# Altium schematic sheet mini80开发板小系统.SchDoc
size A3
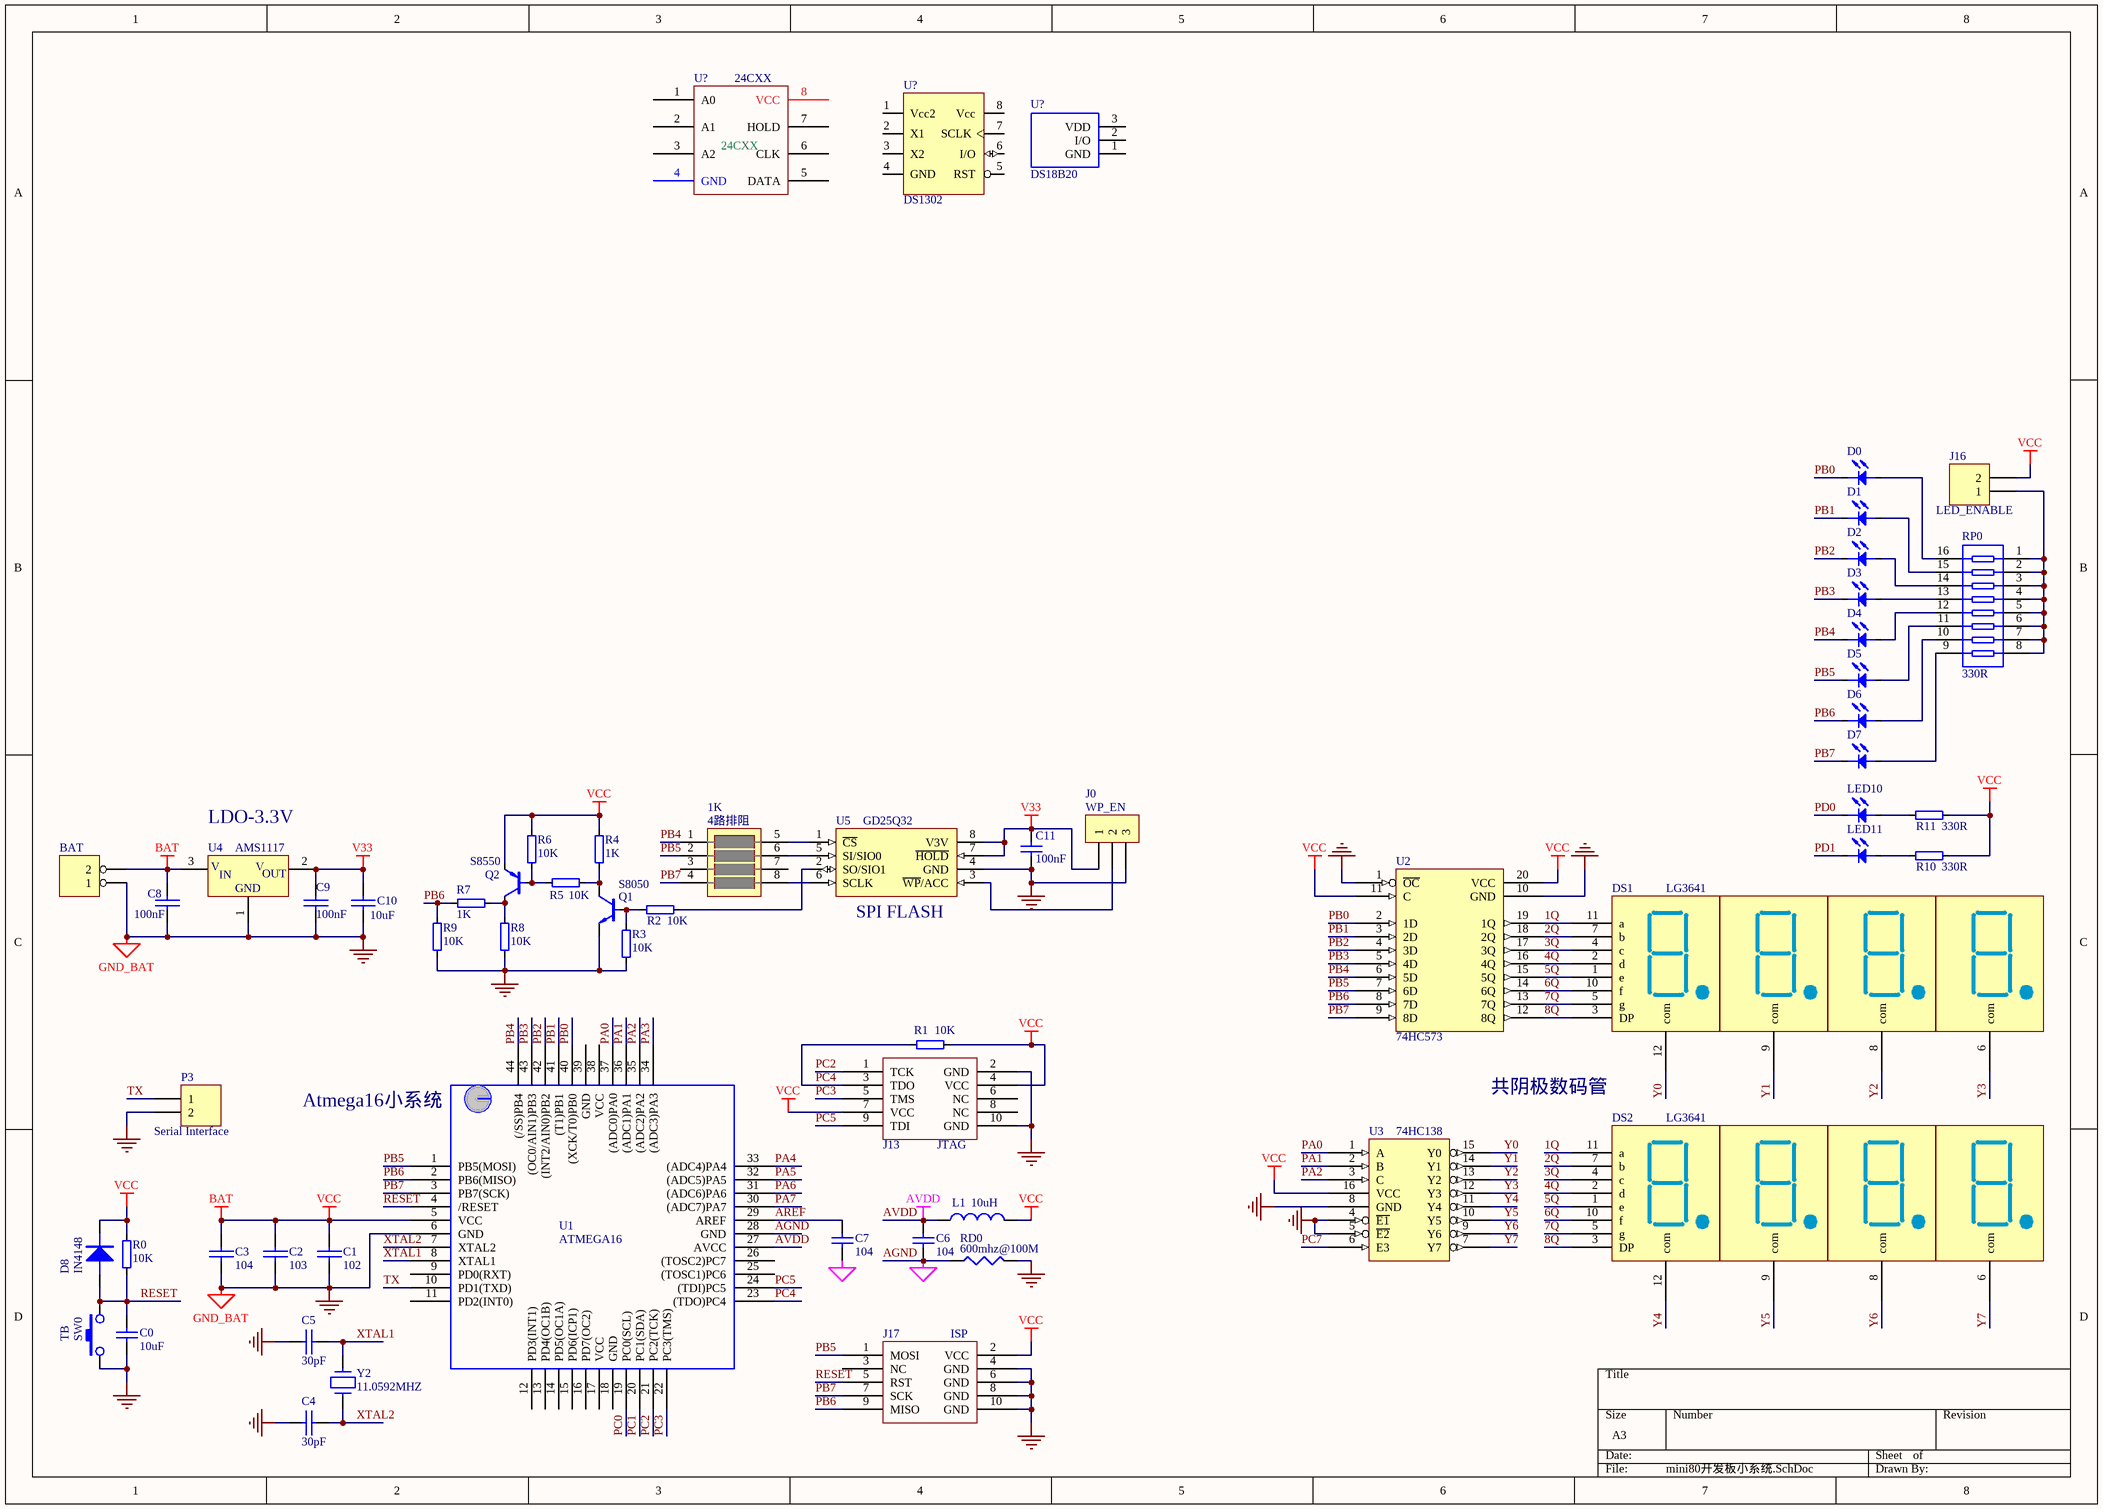
[diagram p0: mini80开发板小系统.SchDoc]

## Parts
(Parts that share a designator on the sheet are numbered #1, #2 ... from top to bottom, then left to right.)
1K  4路排阻
BAT  (no value)  [PH2.0-2P]
C0  10uF  [C-0603]
C1  102  [C-0603]
C2  103  [C-0603]
C3  104  [C-0603]
C4  30pF  [C-0603]
C5  30pF  [C-0603]
C6  104  [C-0603]
C7  104  [C-0603]
C8  100nF  [C-0603]
C9  100nF  [C-0603]
C10  10uF  [C-0805]
C11  100nF  [C-0603]
D0  (no value)  [LED]
D1  (no value)  [LED]
D2  (no value)  [LED]
D3  (no value)  [LED]
D4  (no value)  [LED]
D5  (no value)  [LED]
D6  (no value)  [LED]
D7  (no value)  [LED]
D8  IN4148  [DO-214AC(SMA)]
DS1  LG3641
DS2  LG3641
J0  WP_EN  [DG1283-5.0]
J13  JTAG
J16  LED_ENABLE  [HDR1X2]
J17  ISP
L1  10uH  [R-0603]
LED10  (no value)  [LED]
LED11  (no value)  [LED]
P3  Serial Interface  [HDR1X2]
Q1  S8050  [TO-92]
Q2  S8550  [TO-92]
R0  10K  [AXIAL0.3]
R1  10K  [AXIAL0.3]
R2  10K  [AXIAL0.3]
R3  10K  [AXIAL0.3]
R4  1K  [AXIAL0.3]
R5  10K  [AXIAL0.3]
R6  10K  [AXIAL0.3]
R7  1K  [AXIAL0.3]
R8  10K  [AXIAL0.3]
R9  10K  [AXIAL0.3]
R10  330R  [AXIAL0.3]
R11  330R  [AXIAL0.3]
RD0  600mhz@100M  [R-0603]
RP0  330R  [DIP16]
SW0  TB  [PH2.0-2P]
U1  ATMEGA16
U2  74HC573  [DIP-20]
U3  74HC138  [DIP-16]
U4  AMS1117
U5  GD25Q32  [SOP8-208*1.27]
U?#1  DS1302  [DIP8]
U?#2  DS18B20  [TO-92A]
U?#3  24CXX  [DIP8]
Y2  11.0592MHZ  [MC-146]

## Nets
AGND: C6.1 C7.1 RD0.1 U1.28(GND)
AVDD: C6.2 L1.2 U1.27(AVCC)
BAT: BAT.2 C1.1 C2.1 C3.1 C8.1 D8.2(K) J13.4(VCC) J13.7(VCC) J16.2 J17.2(VCC) L1.1 Q2.E(e) R0.2 R1.2 R4.2 R6.2 R10.2 R11.2 U1.5(VCC) U2.11(C) U2.20(VCC) U3.16(VCC) U4.3(VIN)  [also labelled VCC]
GND: BAT.1 C0.2 C1.2 C2.2 C3.2 C4.2 C5.2 C8.2 C9.2 C10.2 C11.1 J0.3 J13.2(GND) J13.10(GND) J17.4(GND) J17.6(GND) J17.8(GND) J17.10(GND) P3.2 Q1.E(e) R3.1 R8.2 R9.2 RD0.2 SW0.1 U1.6(GND) U2.1(~{OC}) U2.10(GND) U3.4(~{E1}) U3.5(~{E2}) U3.8(GND) U4.1(GND) U5.4(GND)  [also labelled GND_BAT]
V33: C9.1 C10.1 C11.2 J0.1 U4.2(VOUT) U5.7(~{HOLD}) U5.8(V3V)
1Q: DS1.11(a) DS2.11(a) U2.19(1Q)
2Q: DS1.7(b) DS2.7(b) U2.18(2Q)
3Q: DS1.4(c) DS2.4(c) U2.17(3Q)
4Q: DS1.2(d) DS2.2(d) U2.16(4Q)
5Q: DS1.1(e) DS2.1(e) U2.15(5Q)
6Q: DS1.10(f) DS2.10(f) U2.14(6Q)
7Q: DS1.5(g) DS2.5(g) U2.13(7Q)
8Q: DS1.3(DP) DS2.3(DP) U2.12(8Q)
AREF: C7.2 U1.29(AREF)
PA0: U1.37((ADC0)PA0) U3.1(A)
PA1: U1.36((ADC1)PA1) U3.2(B)
PA2: U1.35((ADC2)PA2) U3.3(C)
PA3: U1.34((ADC3)PA3)
PA4: U1.33((ADC4)PA4)
PA5: U1.32((ADC5)PA5)
PA6: U1.31((ADC6)PA6)
PA7: U1.30((ADC7)PA7)
PB0: D0.K U1.40((XCK/T0)PB0) U2.2(1D)
PB1: D1.K U1.41((T1)PB1) U2.3(2D)
PB2: D2.K U1.42((INT2/AIN0)PB2) U2.4(3D)
PB3: D3.K U1.43((OC0/AIN1)PB3) U2.5(4D)
PB4: 1K.1 D4.K U1.44((/SS)PB4) U2.6(5D)
PB5: 1K.2 D5.K J17.1(MOSI) U1.1(PB5(MOSI)) U2.7(6D)
PB6: D6.K J17.9(MISO) R7.2 R9.1 U1.2(PB6(MISO)) U2.8(7D)
PB7: 1K.4 D7.K J17.7(SCK) U1.3(PB7(SCK)) U2.9(8D)
PC0: U1.19(PC0(SCL))
PC1: U1.20(PC1(SDA))
PC2: J13.1(TCK) U1.21(PC2(TCK))
PC3: J13.5(TMS) U1.22(PC3(TMS))
PC4: J13.3(TDO) R1.1 U1.23((TDO)PC4)
PC5: J13.9(TDI) U1.24((TDI)PC5)
PC7: U3.6(E3)
PD0: LED10.K
PD1: LED11.K
RESET: C0.1 D8.1(A) J17.5(RST) R0.1 SW0.2 U1.4(/RESET)
TX: P3.1 U1.10(PD1(TXD))
XTAL1: C5.1 U1.8(XTAL1) Y2.1
XTAL2: C4.1 U1.7(XTAL2) Y2.2
Y0: DS1.12(com) U3.15(Y0)
Y1: DS1.9(com) U3.14(Y1)
Y2: DS1.8(com) U3.13(Y2)
Y3: DS1.6(com) U3.12(Y3)
Y4: DS2.12(com) U3.11(Y4)
Y5: DS2.9(com) U3.10(Y5)
Y6: DS2.8(com) U3.9(Y6)
Y7: DS2.6(com) U3.7(Y7)
Net1K_5: 1K.5 U5.1(~{CS})
Net1K_6: 1K.6 U5.5(SI/SIO0)
Net1K_8: 1K.8 U5.6(SCLK)
NetD0_A: D0.A RP0.16
NetD1_A: D1.A RP0.15
NetD2_A: D2.A RP0.14
NetD3_A: D3.A RP0.13
NetD4_A: D4.A RP0.12
NetD5_A: D5.A RP0.11
NetD6_A: D6.A RP0.10
NetD7_A: D7.A RP0.9
NetJ0_2: J0.2 U5.3(~{WP}/ACC)
NetJ16_1: J16.1 RP0.1 RP0.2 RP0.3 RP0.4 RP0.5 RP0.6 RP0.7 RP0.8
NetLED10_A: LED10.A R11.1
NetLED11_A: LED11.A R10.1
NetQ1_B: Q1.B(b) R2.1 R3.2
NetQ1_C: Q1.C(c) R4.1 R5.2
NetQ2_B: Q2.B(b) R5.1 R6.1
NetQ2_C: Q2.C(c) R7.1 R8.1
NetR2_2: R2.2 U5.2(SO/SIO1)

Not connected (* = marked no-connect by the designer): 1K 3 7; J13 6(NC) 8(NC); J17 3(NC); U1 9(PD0(RXT)) 11(PD2(INT0)) 12(PD3(INT1)) 13(PD4(OC1B)) 14(PD5(OC1A)) 15(PD6(ICP1)) 16(PD7(OC2)) 17(VCC) 18(GND) 25((TOSC1)PC6) 26((TOSC2)PC7) 38(VCC) 39(GND); U?#1 1(Vcc2) 2(X1) 3(X2) 4(GND) 5(RST) 6(I/O) 7(SCLK) 8(Vcc); U?#2 1(GND) 2(I/O) 3(VDD); U?#3 1(A0) 2(A1) 3(A2) 4(GND) 5(DATA) 6(CLK) 7(HOLD) 8(VCC)

## Notes on the sheet
- (near U4) LDO-3.3V
- (near U5) SPI FLASH
- (near U1) Atmega16小系统
- 共阴极数码管
- (in symbol AMS1117) V; IN; OUT

## Library data of the parts
BAT = HEADER 2
C0 C11 = Cap: Capacitor; Published: 8-Jun-2000; LatestRevisionDate: 17-Jul-2002; LatestRevisionNote: Re-released for DXP Platform.; Publisher: Altium Limited
  C11: PackageReference: RAD-0.3; Value: 100nF
C1-C5 C8-C10 = CAP: Capacitor
C6 C7 = Cap Semi: Capacitor (Semiconductor SIM Model); Value: 0.1uF; Published: 8-Jun-2000; LatestRevisionDate: 17-Jul-2002; LatestRevisionNote: Re-released for DXP Platform.; PackageReference: C1206; Publisher: Altium Limited
D0-D7 LED10 LED11 = LED
D8 = DIODE
DS1 DS2 = LED_8*4_SEG
J0 = CON3
J16 P3 = Header 2: Header, 2-Pin; LatestRevisionDate: 17-Jul-2002; LatestRevisionNote: Re-released for DXP Platform.; Publisher: Altium Limited
L1 = BEAD
Q1 = NPN
Q2 = PNP
R0-R11 RD0 = RES
RP0 = RESPACK4
SW0 = SW-PB
U5 = MX25Lxxx5D
Y2 = CRYSTAL